# EAGLE schematic usb_key (EAGLE 6.2)
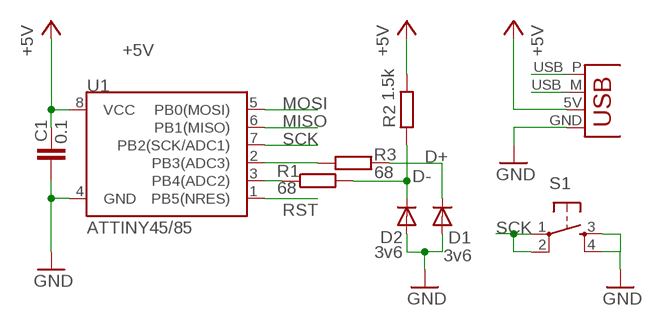
[diagram p0: schematic, sheet 1]

## Parts
C1  0.1  C-EUC0805  [C0805]
D1  3v6  DIODE-MINIMELF  [MINIMELF]
D2  3v6  DIODE-MINIMELF  [MINIMELF]
R1  68  R-EU_R0805  [R0805]
R2  1.5k  R-EU_R0805  [R0805]
R3  68  R-EU_R0805  [R0805]
S1  TAC_SWITCHSMD  [TACTILE_SWITCH_SMD]
U1  ATTINY45/85  ATTINY45  [SO08-EIAJ]
X1  USBPCB  [USB-A-PCB]

## Nets
+5V: C1.1 R2.2 U1.8(VCC) X1.5V(VBUS)
D+: D1.C R3.2
D-: D2.C R1.2 R2.1
GND: C1.2 D1.A D2.A S1.3 S1.4 U1.4(GND) X1.GND
MISO: U1.6(PB1(MISO))
MOSI: U1.5(PB0(MOSI))
N$1: X1.USB_M(D-)
N$2: X1.USB_P(D+)
PB3: R3.1 U1.2(PB3(ADC3))
PB4: R1.1 U1.3(PB4(ADC2))
RST: U1.1(PB5(NRES))
SCK: S1.1 S1.2 U1.7(PB2(SCK/ADC1))

## Library data of the parts
C1 = rcl:C-EU: CAPACITOR, European symbol
D1 D2 = diode:DIODE-: DIODE
R1-R3 = rcl:R-EU_: RESISTOR, European symbol
S1 = SparkFun:TAC_SWITCH: Momentary Switch Button commonly used for reset or general input. Spark Fun Electronics SKU : COM-00097
U1 = SparkFun:ATTINY45: Atmel ATTiny45
X1 = SparkFun:USB: USB Connectors USB-B-PTH is fully proven SKU : PRT-00139 USB-miniB is fully proven SKU : PRT-00587 USB-A-PCB is untested. USB-A-H is throughly reviewed, but untested. Spark Fun Electronics SKU : PRT-00437 USB-B-SMT is throughly reviewed, but untested. Needs silkscreen touching up. USB-A-S has not been used/tested USB-MB-H has not been used/tested